# EAGLE design Taller Arrancador EAGLE V1.0.0 (EAGLE 9.6.2)
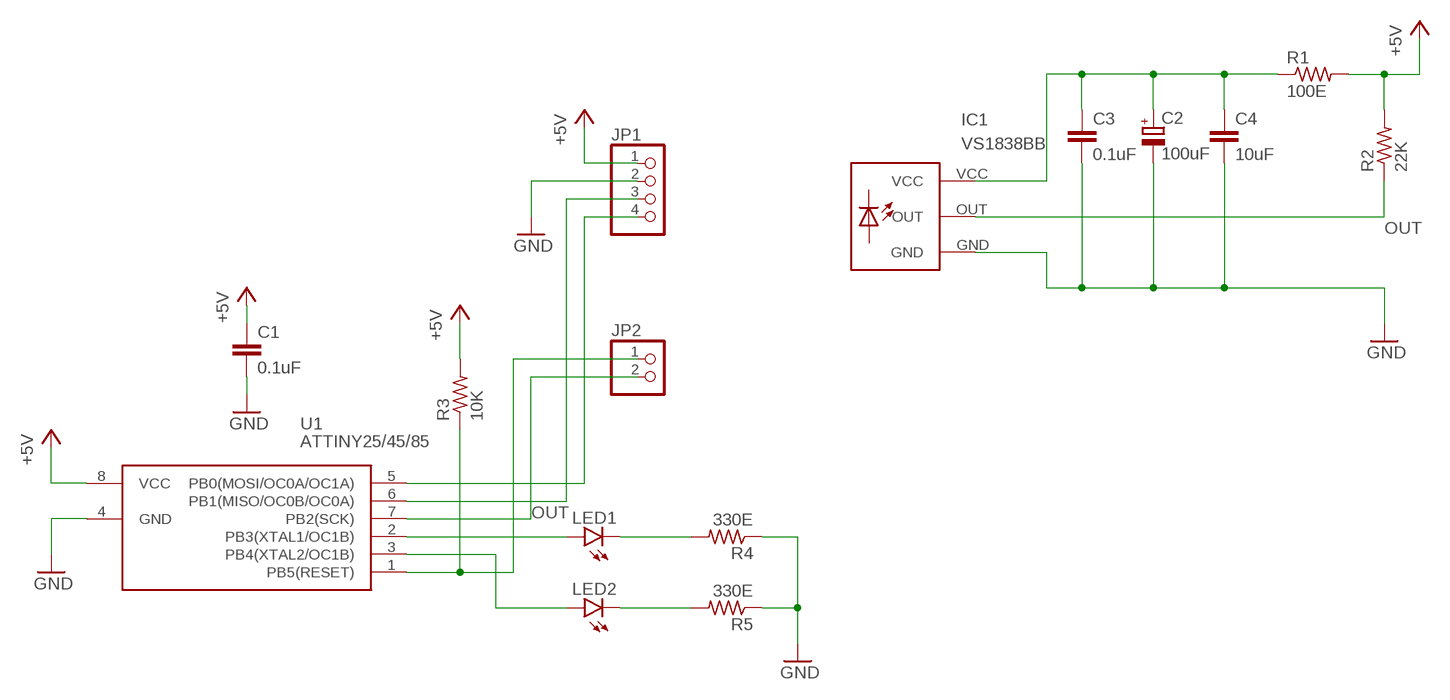
[diagram p0: schematic, sheet 1]

## Parts
C1  0.1uF  C-EUC0603  [C0603]
C2  100uF  CPOL-EUCT3216  [CT3216]
C3  0.1uF  C-EUC0603  [C0603]
C4  10uF  C-EUC0603  [C0603]
IC1  VS1838BB  [VS1838B]
JP1  PINHD-1X04_2.54-S  [1X04-S]
JP2  PINHD-1X02_2.54-S  [1X02-S]
LED1  LEDCHIP-LED0603  [CHIP-LED0603]
LED2  LEDCHIP-LED0603  [CHIP-LED0603]
R1  100E  R-US_R0603  [R0603]
R2  22K  R-US_R0603  [R0603]
R3  10K  R-US_R0603  [R0603]
R4  330E  R-US_R0603  [R0603]
R5  330E  R-US_R0603  [R0603]
U1  ATTINY25/45/85  [TSSOP-8]

## Nets
+5V: C1.1 JP1.1 R1.2 R2.2 R3.2 U1.8(VCC)
GND: C1.2 C2.- C3.2 C4.2 IC1.GND JP1.2 R4.1 R5.1 U1.4(GND)
N$1: C2.+ C3.1 C4.1 IC1.VCC R1.1
N$3: LED1.A U1.2(PB3(XTAL1/OC1B))
N$4: LED1.C R4.2
N$5: JP2.1 R3.1 U1.1(PB5(RESET))
N$6: LED2.A U1.3(PB4(XTAL2/OC1B))
N$7: LED2.C R5.2
N$8: JP1.4 U1.5(PB0(MOSI/OC0A/OC1A))
N$9: JP1.3 U1.6(PB1(MISO/OC0B/OC0A))
OUT: IC1.OUT JP2.2 R2.1 U1.7(PB2(SCK))

## Library data of the parts
C1 C3 C4 = rcl:C-EU: CAPACITOR, European symbol; SPICEPREFIX: C
C2 = rcl:CPOL-EU: POLARIZED CAPACITOR, European symbol; SPICEPREFIX: C
IC1 = LFN-VS1838B_Infrared_Sensor:VS1838B: LFN - VS1838B - 38KHz Infrared Receiver NoMADA® Industries - Embedded Design... A Step Further
JP1 = pinhead-2:PINHD-1X04: PIN HEADER
JP2 = pinhead-2:PINHD-1X02: PIN HEADER
LED1 LED2 = led:LED: LED OSRAM: - CHIPLED LG R971, LG N971, LY N971, LG Q971, LY Q971, LO R971, LY R971 LH N974, LH R974 LS Q976, LO Q976, LY Q976 LO Q996 - Hyper CHIPLED LW Q18S LB Q993, LB Q99A, LB R99A - SideLED LS A670, LO A670, LY A670, LG A670, LP A670 LB A673, LV A673, LT A673, LW A673 LH A674 LY A675 LS A676, LA A676, LO A676, LY A676, LW A676 LS A679, LY A679, LG A679 - Hyper Micro SIDELED® LS Y876, LA Y876, LO Y876, LY Y876 LT Y87S - SmartLED LW L88C, LW L88S LB L89C, LB L89S, LG L890 LS L89K, LO L89K, LY L89K LS L896, LA L896, LO L896, LY L896 - TOPLED LS T670, LO T670, LY T670, LG T670, LP T670 LSG T670, LSP T670, LSY T670, LOP T670, LYG T670 LG T671, LOG T671, LSG T671 LB T673, LV T673, LT T673, LW T673 LH T674 LS T676, LA T676, LO T676, LY T676, LB T676, LH T676, LSB T676, LW T676 LB T67C, LV T67C, LT T67C, LS T67K, LO T67K, LY T67K, LW E67C LS E67B, LA E67B, LO E67B, LY E67B, LB E67C, LV E67C, LT E67C LW T67C LS T679, LY T679, LG T679 LS T770, LO T770, LY T770, LG T770, LP T770 LB T773, LV T773, LT T773, LW T773 LH T774 LS E675, LA E675, LY E675, LS T675 LS T776, LA T776, LO T776, LY T776, LB T776 LHGB T686 LT T68C, LB T68C - Hyper Mini TOPLED® LB M676 - Mini TOPLED Santana® LG M470 LS M47K, LO M47K, LY M47K Source: http://www.osram.convergy.de LUXEON: - LUMILED® LXK2-PW12-R00, LXK2-PW12-S00, LXK2-PW14-U00, LXK2-PW14-V00 LXK2-PM12-R00, LXK2-PM12-S00, LXK2-PM14-U00 LXK2-PE12-Q00, LXK2-PE12-R00, LXK2-PE12-S00, LXK2-PE14-T00, LXK2-PE14-U00 LXK2-PB12-K00, LXK2-PB12-L00, LXK2-PB12-M00, LXK2-PB14-N00, LXK2-PB14-P00, LXK2-PB14-Q00 LXK2-PR12-L00, LXK2-PR12-M00, LXK2-PR14-Q00, LXK2-PR14-R00 LXK2-PD12-Q00, LXK2-PD12-R00, LXK2-PD12-S00 LXK2-PH12-R00, LXK2-PH12-S00 LXK2-PL12-P00, LXK2-PL12-Q00, LXK2-PL12-R00 Source: www.luxeon.com KINGBRIGHT: KA-3528ASYC Source: www.kingbright.com
R1-R5 = rcl:R-US_: RESISTOR, American symbol; SPICEPREFIX: R
U1 = ATMEL-ATTINY25-45-85:ATTINY25/45/85

## Board
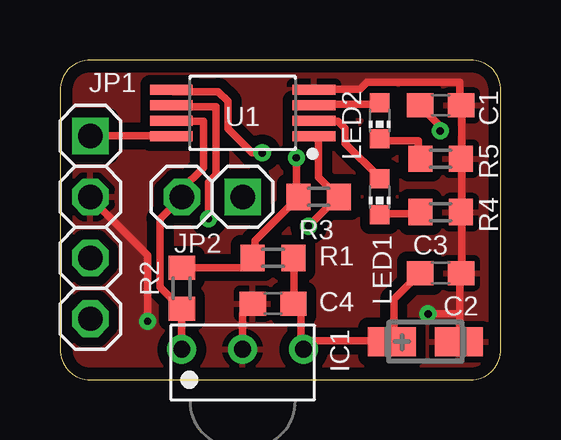
[diagram p1: board, top side]
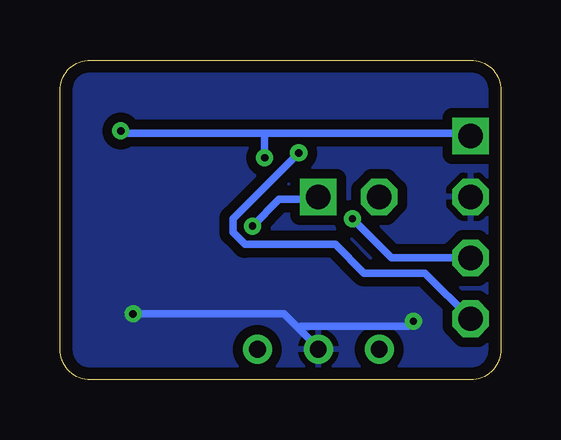
[diagram p2: board, bottom side, seen from below]

Size 18.39 x 13.32 mm. Coordinates in mm from the lower left corner, seen from the top.
Outline: 0,12.05 0,1.27 arc90 1.27,0 17.12,0 arc90 18.39,1.27 18.39,12.05 arc90 17.12,13.32 1.27,13.32 arc90 0,12.05
Copper layers (1*16): Top 0.035mm / dielectric 1.5mm / Bottom 0.035mm
Design rules "default *": minimum track width 12mil, minimum drill 12mil, track to track 8mil, track to pad 8mil, pad to pad 8mil, via to via 10mil, smd to smd 0mil, copper to edge 20mil, drill to drill 6mil, minimum pad ring 10mil, minimum via ring 8mil, stop-mask expansion 4mil, vias tented up to drill 12mil, thermal gap 10mil

### Footprints (pad centres in the part's own frame; a part is rotated, then mirrored left to right if it is on the bottom)
C0603 = smd 1.1 x 1: 1 -0.85,0; 2 0.85,0
CT3216 = smd 2 x 1.2: + -1.4,0; - 1.4,0
VS1838B = drill 0.7: GND 0,0; OUT -2.54,0; VCC 2.54,0
1X04-S = drill 1.016 square: 1 -3.81,0 | drill 1.016 octagon: 2 -1.27,0; 3 1.27,0; 4 3.81,0
1X02-S = drill 1.016 square: 1 -1.27,0 | drill 1.016 octagon: 2 1.27,0
CHIP-LED0603 = smd 0.8 x 0.8: A 0,-0.75; C 0,0.75
R0603 = smd 1 x 1.1: 1 -0.85,0; 2 0.85,0
TSSOP-8 = smd 1.78 x 0.42: 1 -2.97,0.975; 2 -2.97,0.325; 3 -2.97,-0.325; 4 -2.97,-0.975; 5 2.97,-0.975; 6 2.97,-0.325; 7 2.97,0.325; 8 2.97,0.975

### Placement (x,y rotation side)
C1  15.88,11.43 0 top
C2  15.24,1.59 0 top
C3  15.88,4.45 0 top
C4  8.89,3.17 180 top
IC1  7.62,1.27 0 top
JP1  1.27,6.35 270 top
JP2  6.35,7.62 180 top
LED1  13.34,7.62 180 top
LED2  13.34,10.79 180 top
R1  8.89,5.08 180 top
R2  5.08,3.81 90 top
R3  10.79,7.62 180 top
R4  15.88,6.99 180 top
R5  15.88,9.21 180 top
U1  7.62,11.11 180 top

### Tracks (layer width: path | path; a pad name or v marks a point on that pad's centre or on a via)
+5V  (via drill 0.3)
  Top 0.305: R2.2 5.08,4.67 8.03,4.67 8.03,4.98 R1.2 8.13,5.18 8.13,5.79 9.86,7.52 R3.2 9.86,7.72 v9.86,9.25 | v15.86,10.37 15.86,10.57 15.04,11.38 C1.1 | U1.8 4.57,10.16 1.32,10.16 JP1.1
  Bottom 0.305: v15.86,10.37 15.75,10.27 9.86,10.27 | 9.86,10.27 1.42,10.27 1.32,10.16 JP1.1 | 9.86,10.27 v9.86,9.25
GND  (via drill 0.3)
  Top 0.305: C4.2 8.03,3.15 7.62,2.74 7.62,1.32 IC1.GND | U1.4 10.67,12.1 12.5,12.1 12.81,12.4 16.67,12.4 16.67,11.48 C1.2 16.77,11.38 16.77,9.35 R5.1 16.77,9.15 16.77,7.12 R4.1 16.77,6.91 16.77,4.47 C3.2 16.67,4.37 16.67,2.74 | 16.67,2.74 16.67,1.63 C2.- | 16.67,2.74 v15.35,2.74 | v3.66,2.44 3.66,5.18 1.32,7.52 JP1.2
  Bottom 0.305: 8.44,2.13 9.05,2.74 v15.35,2.74 | 8.44,2.13 7.62,1.32 IC1.GND | v3.66,2.44 3.86,2.24 8.33,2.24 8.44,2.13
  pour Top (isolate 0.406): 0,0 0,13.34 18.41,13.34 18.41,0
  pour Bottom (isolate 0.406): 0,0 0,13.34 18.41,13.34 18.41,0
N$1
  Top 0.305: C3.1 14.94,4.37 13.93,3.35 13.93,1.63 C2.+ 13.72,1.63 10.16,1.63 IC1.VCC 10.06,1.32 10.06,2.74 9.76,3.05 C4.1 9.76,3.25 9.76,4.98 R1.1
N$3
  Top 0.305: LED1.A 13.31,8.44 11.89,9.86 11.89,10.47 11.59,10.77 10.67,10.77 U1.2
N$4
  Top 0.305: LED1.C 13.42,6.91 14.94,6.91 R4.2
N$5  (via drill 0.3)
  Top 0.305: U1.1 10.67,10.06 10.77,9.96 10.77,8.44 11.59,7.62 R3.1 11.48,7.52 v10.37,6.4
  Bottom 0.305: v10.37,6.4 9.25,7.52 7.62,7.52 JP2.1
N$6
  Top 0.305: LED2.A 13.31,11.48 10.67,11.48 U1.3
N$7
  Top 0.305: LED2.C 13.42,9.96 14.94,9.96 14.94,9.25 R5.2
N$8  (via drill 0.3)
  Top 0.305: 4.67,12.1 U1.5 4.73,12 6.6,12 7.01,11.59 7.01,10.45 8.01,9.45 v8.44,9.45
  Bottom 0.305: v8.44,9.45 11.18,6.71 11.18,6.14 10.68,5.64 6.91,5.64 5.71,4.45 3.17,4.45 JP1.4
N$9  (via drill 0.3)
  Top 0.305: v6.2,6.71 6.2,8.23 6.5,8.54 6.5,11.38 4.67,11.38 U1.6
  Bottom 0.305: v6.2,6.71 4.57,5.08 1.32,5.08 JP1.3
OUT
  Top 0.305: IC1.OUT 5.08,1.32 5.08,2.95 R2.1 4.98,3.05 4.17,3.86 4.17,6.71 4.98,7.52 JP2.2 5.08,7.93 6,8.84 6,10.77 4.67,10.77 U1.7